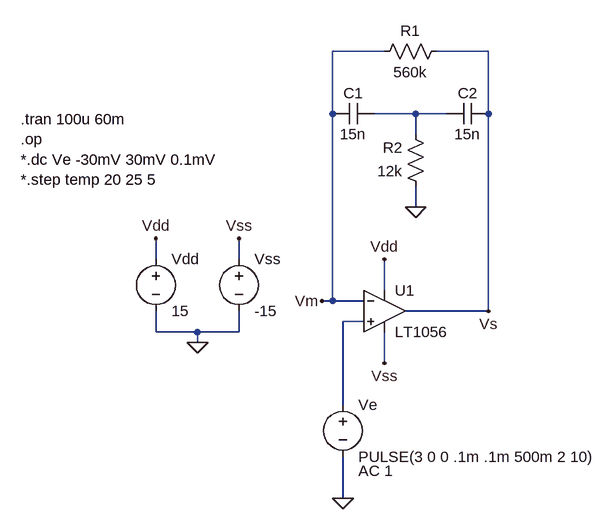
[diagram p0: schematic kick-drum.asc]
kick-drum.asc, the LTspice schematic file:
Version 4
SHEET 1 1440 680
WIRE 1008 -176 928 -176
WIRE 1168 -176 1088 -176
WIRE 928 -80 928 -176
WIRE 1056 -80 992 -80
WIRE 1104 -80 1056 -80
WIRE 1168 -80 1168 -176
WIRE 1056 -48 1056 -80
WIRE 1056 64 1056 32
WIRE 656 144 656 112
WIRE 784 144 784 112
WIRE 1008 192 1008 144
WIRE 928 208 928 -80
WIRE 928 208 912 208
WIRE 976 208 928 208
WIRE 1168 224 1168 -80
WIRE 1168 224 1040 224
WIRE 976 240 944 240
WIRE 656 256 656 224
WIRE 720 256 656 256
WIRE 784 256 784 224
WIRE 784 256 720 256
WIRE 720 272 720 256
WIRE 1008 304 1008 256
WIRE 944 368 944 240
WIRE 944 512 944 448
FLAG 720 272 0
FLAG 656 112 Vdd
FLAG 784 112 Vss
FLAG 944 512 0
FLAG 912 208 Vm
FLAG 1168 224 Vs
FLAG 1056 64 0
FLAG 1008 144 Vdd
FLAG 1008 304 Vss
SYMBOL Opamps/LT1056 1008 160 R0
SYMATTR InstName U1
SYMBOL voltage 656 128 R0
SYMATTR InstName Vdd
SYMATTR Value 15
SYMBOL voltage 784 128 R0
SYMATTR InstName Vss
SYMATTR Value -15
SYMBOL voltage 944 352 R0
WINDOW 123 24 118 Left 2
SYMATTR Value2 AC 1
SYMATTR InstName Ve
SYMATTR Value PULSE(3 0 0 .1m .1m 500m 2 10)
SYMBOL cap 992 -96 R90
WINDOW 0 0 32 VBottom 2
WINDOW 3 32 32 VTop 2
SYMATTR InstName C1
SYMATTR Value 15n
SYMBOL cap 1168 -96 R90
WINDOW 0 0 32 VBottom 2
WINDOW 3 32 32 VTop 2
SYMATTR InstName C2
SYMATTR Value 15n
SYMBOL res 1104 -192 R90
WINDOW 0 0 56 VBottom 2
WINDOW 3 32 56 VTop 2
SYMATTR InstName R1
SYMATTR Value 560k
SYMBOL res 1072 48 R180
WINDOW 0 36 76 Left 2
WINDOW 3 36 40 Left 2
SYMATTR InstName R2
SYMATTR Value 12k
TEXT 448 -72 Left 2 !.tran 100u 60m\n.op\n*.dc Ve -30mV 30mV 0.1mV\n*.step temp 20 25 5

The netlist it stands for:
* kick-drum.asc
XU1 N002 Vm Vdd Vss Vs LT1056  ; pins In+ In- V+ V- OUT
Vdd Vdd 0 15
Vss Vss 0 -15
Ve N002 0 PULSE(3 0 0 .1m .1m 500m 2 10) AC 1
C1 N001 Vm 15n
C2 Vs N001 15n
R1 Vs Vm 560k
R2 0 N001 12k
.tran 100u 60m
.op
*.dc Ve -30mV 30mV 0.1mV
*.step temp 20 25 5
.backanno
.end